# Altium project Zilents_TKL.PrjPCB
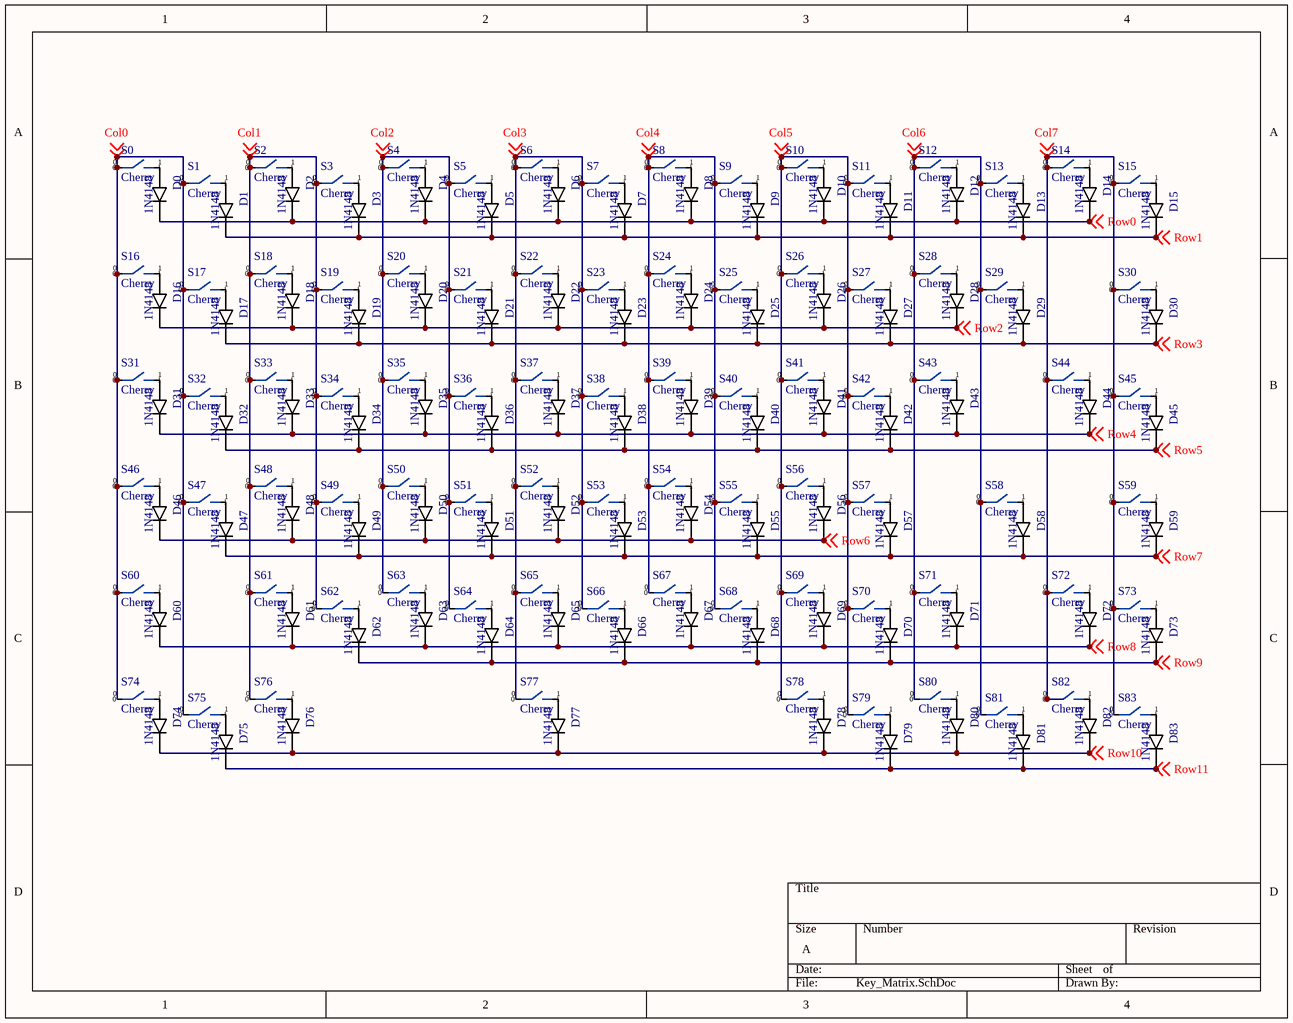
[diagram p0: Key_Matrix.SchDoc]
2 sheets, 337 parts. Net scope: global (net labels, ports and power ports of the same name join across sheets).
Board file: Yun75.PcbDoc
Sheets:
  Key_Matrix.SchDoc
  RGB_Matrix.SchDoc

## Sheet Key_Matrix.SchDoc
size A

### Parts
D0  1N4148  [DIOAD829W49L456D191_1N4148(Primary)]
D1  1N4148  [DIOAD829W49L456D191_1N4148(Primary)]
D2  1N4148  [DIOAD829W49L456D191_1N4148(Primary)]
D3  1N4148  [DIOAD829W49L456D191_1N4148(Primary)]
D4  1N4148  [DIOAD829W49L456D191_1N4148(Primary)]
D5  1N4148  [DIOAD829W49L456D191_1N4148(Primary)]
D6  1N4148  [DIOAD829W49L456D191_1N4148(Primary)]
D7  1N4148  [DIOAD829W49L456D191_1N4148(Primary)]
D8  1N4148  [DIOAD829W49L456D191_1N4148(Primary)]
D9  1N4148  [DIOAD829W49L456D191_1N4148(Primary)]
D10  1N4148  [DIOAD829W49L456D191_1N4148(Primary)]
D11  1N4148  [DIOAD829W49L456D191_1N4148(Primary)]
D12  1N4148  [DIOAD829W49L456D191_1N4148(Primary)]
D13  1N4148  [DIOAD829W49L456D191_1N4148(Primary)]
D14  1N4148  [DIOAD829W49L456D191_1N4148(Primary)]
D15  1N4148  [DIOAD829W49L456D191_1N4148(Primary)]
D16  1N4148  [DIOAD829W49L456D191_1N4148(Primary)]
D17  1N4148  [DIOAD829W49L456D191_1N4148(Primary)]
D18  1N4148  [DIOAD829W49L456D191_1N4148(Primary)]
D19  1N4148  [DIOAD829W49L456D191_1N4148(Primary)]
D20  1N4148  [DIOAD829W49L456D191_1N4148(Primary)]
D21  1N4148  [DIOAD829W49L456D191_1N4148(Primary)]
D22  1N4148  [DIOAD829W49L456D191_1N4148(Primary)]
D23  1N4148  [DIOAD829W49L456D191_1N4148(Primary)]
D24  1N4148  [DIOAD829W49L456D191_1N4148(Primary)]
D25  1N4148  [DIOAD829W49L456D191_1N4148(Primary)]
D26  1N4148  [DIOAD829W49L456D191_1N4148(Primary)]
D27  1N4148  [DIOAD829W49L456D191_1N4148(Primary)]
D28  1N4148  [DIOAD829W49L456D191_1N4148(Primary)]
D29  1N4148  [DIOAD829W49L456D191_1N4148(Primary)]
D30  1N4148  [DIOAD829W49L456D191_1N4148(Primary)]
D31  1N4148  [DIOAD829W49L456D191_1N4148(Primary)]
D32  1N4148  [DIOAD829W49L456D191_1N4148(Primary)]
D33  1N4148  [DIOAD829W49L456D191_1N4148(Primary)]
D34  1N4148  [DIOAD829W49L456D191_1N4148(Primary)]
D35  1N4148  [DIOAD829W49L456D191_1N4148(Primary)]
D36  1N4148  [DIOAD829W49L456D191_1N4148(Primary)]
D37  1N4148  [DIOAD829W49L456D191_1N4148(Primary)]
D38  1N4148  [DIOAD829W49L456D191_1N4148(Primary)]
D39  1N4148  [DIOAD829W49L456D191_1N4148(Primary)]
D40  1N4148  [DIOAD829W49L456D191_1N4148(Primary)]
D41  1N4148  [DIOAD829W49L456D191_1N4148(Primary)]
D42  1N4148  [DIOAD829W49L456D191_1N4148(Primary)]
D43  1N4148  [DIOAD829W49L456D191_1N4148(Primary)]
D44  1N4148  [DIOAD829W49L456D191_1N4148(Primary)]
D45  1N4148  [DIOAD829W49L456D191_1N4148(Primary)]
D46  1N4148  [DIOAD829W49L456D191_1N4148(Primary)]
D47  1N4148  [DIOAD829W49L456D191_1N4148(Primary)]
D48  1N4148  [DIOAD829W49L456D191_1N4148(Primary)]
D49  1N4148  [DIOAD829W49L456D191_1N4148(Primary)]
D50  1N4148  [DIOAD829W49L456D191_1N4148(Primary)]
D51  1N4148  [DIOAD829W49L456D191_1N4148(Primary)]
D52  1N4148  [DIOAD829W49L456D191_1N4148(Primary)]
D53  1N4148  [DIOAD829W49L456D191_1N4148(Primary)]
D54  1N4148  [DIOAD829W49L456D191_1N4148(Primary)]
D55  1N4148  [DIOAD829W49L456D191_1N4148(Primary)]
D56  1N4148  [DIOAD829W49L456D191_1N4148(Primary)]
D57  1N4148  [DIOAD829W49L456D191_1N4148(Primary)]
D58  1N4148  [DIOAD829W49L456D191_1N4148(Primary)]
D59  1N4148  [DIOAD829W49L456D191_1N4148(Primary)]
D60  1N4148  [DIOAD829W49L456D191_1N4148(Primary)]
D61  1N4148  [DIOAD829W49L456D191_1N4148(Primary)]
D62  1N4148  [DIOAD829W49L456D191_1N4148(Primary)]
D63  1N4148  [DIOAD829W49L456D191_1N4148(Primary)]
D64  1N4148  [DIOAD829W49L456D191_1N4148(Primary)]
D65  1N4148  [DIOAD829W49L456D191_1N4148(Primary)]
D66  1N4148  [DIOAD829W49L456D191_1N4148(Primary)]
D67  1N4148  [DIOAD829W49L456D191_1N4148(Primary)]
D68  1N4148  [DIOAD829W49L456D191_1N4148(Primary)]
D69  1N4148  [DIOAD829W49L456D191_1N4148(Primary)]
D70  1N4148  [DIOAD829W49L456D191_1N4148(Primary)]
D71  1N4148  [DIOAD829W49L456D191_1N4148(Primary)]
D72  1N4148  [DIOAD829W49L456D191_1N4148(Primary)]
D73  1N4148  [DIOAD829W49L456D191_1N4148(Primary)]
D74  1N4148  [DIOAD829W49L456D191_1N4148(Primary)]
D75  1N4148  [DIOAD829W49L456D191_1N4148(Primary)]
D76  1N4148  [DIOAD829W49L456D191_1N4148(Primary)]
D77  1N4148  [DIOAD829W49L456D191_1N4148(Primary)]
D78  1N4148  [DIOAD829W49L456D191_1N4148(Primary)]
D79  1N4148  [DIOAD829W49L456D191_1N4148(Primary)]
D80  1N4148  [DIOAD829W49L456D191_1N4148(Primary)]
D81  1N4148  [DIOAD829W49L456D191_1N4148(Primary)]
D82  1N4148  [DIOAD829W49L456D191_1N4148(Primary)]
D83  1N4148  [DIOAD829W49L456D191_1N4148(Primary)]
S0  Cherry  [CHERRY-MX-LED-1U]
S1  Cherry  [CHERRY-MX-LED-1U]
S2  Cherry  [CHERRY-MX-LED-1U]
S3  Cherry  [CHERRY-MX-LED-1U]
S4  Cherry  [CHERRY-MX-LED-1U]
S5  Cherry  [CHERRY-MX-LED-1U]
S6  Cherry  [CHERRY-MX-LED-1U]
S7  Cherry  [CHERRY-MX-LED-1U]
S8  Cherry  [CHERRY-MX-LED-1U]
S9  Cherry  [CHERRY-MX-LED-1U]
S10  Cherry  [CHERRY-MX-LED-1U]
S11  Cherry  [CHERRY-MX-LED-1U]
S12  Cherry  [CHERRY-MX-LED-1U]
S13  Cherry  [CHERRY-MX-LED-1U]
S14  Cherry  [CHERRY-MX-LED-1U]
S15  Cherry  [CHERRY-MX-LED-1U]
S16  Cherry  [CHERRY-MX-LED-1U]
S17  Cherry  [CHERRY-MX-LED-1U]
S18  Cherry  [CHERRY-MX-LED-1U]
S19  Cherry  [CHERRY-MX-LED-1U]
S20  Cherry  [CHERRY-MX-LED-1U]
S21  Cherry  [CHERRY-MX-LED-1U]
S22  Cherry  [CHERRY-MX-LED-1U]
S23  Cherry  [CHERRY-MX-LED-1U]
S24  Cherry  [CHERRY-MX-LED-1U]
S25  Cherry  [CHERRY-MX-LED-1U]
S26  Cherry  [CHERRY-MX-LED-1U]
S27  Cherry  [CHERRY-MX-LED-1U]
S28  Cherry  [CHERRY-MX-LED-1U]
S29  Cherry  [CHERRY-MX-LED-1U]
S30  Cherry  [CHERRY-MX-LED-1U]
S31  Cherry  [CHERRY-MX-LED-1U]
S32  Cherry  [CHERRY-MX-LED-1U]
S33  Cherry  [CHERRY-MX-LED-1U]
S34  Cherry  [CHERRY-MX-LED-1U]
S35  Cherry  [CHERRY-MX-LED-1U]
S36  Cherry  [CHERRY-MX-LED-1U]
S37  Cherry  [CHERRY-MX-LED-1U]
S38  Cherry  [CHERRY-MX-LED-1U]
S39  Cherry  [CHERRY-MX-LED-1U]
S40  Cherry  [CHERRY-MX-LED-1U]
S41  Cherry  [CHERRY-MX-LED-1U]
S42  Cherry  [CHERRY-MX-LED-1U]
S43  Cherry  [CHERRY-MX-LED-1U]
S44  Cherry  [CHERRY-MX-LED-1U]
S45  Cherry  [CHERRY-MX-LED-1U]
S46  Cherry  [CHERRY-MX-LED-1U]
S47  Cherry  [CHERRY-MX-LED-1U]
S48  Cherry  [CHERRY-MX-LED-1U]
S49  Cherry  [CHERRY-MX-LED-1U]
S50  Cherry  [CHERRY-MX-LED-1U]
S51  Cherry  [CHERRY-MX-LED-1U]
S52  Cherry  [CHERRY-MX-LED-1U]
S53  Cherry  [CHERRY-MX-LED-1U]
S54  Cherry  [CHERRY-MX-LED-1U]
S55  Cherry  [CHERRY-MX-LED-1U]
S56  Cherry  [CHERRY-MX-LED-1U]
S57  Cherry  [CHERRY-MX-LED-1U]
S58  Cherry  [CHERRY-MX-LED-1U]
S59  Cherry  [CHERRY-MX-LED-1U]
S60  Cherry  [CHERRY-MX-LED-1U]
S61  Cherry  [CHERRY-MX-LED-1U]
S62  Cherry  [CHERRY-MX-LED-1U]
S63  Cherry  [CHERRY-MX-LED-1U]
S64  Cherry  [CHERRY-MX-LED-1U]
S65  Cherry  [CHERRY-MX-LED-1U]
S66  Cherry  [CHERRY-MX-LED-1U]
S67  Cherry  [CHERRY-MX-LED-1U]
S68  Cherry  [CHERRY-MX-LED-1U]
S69  Cherry  [CHERRY-MX-LED-1U]
S70  Cherry  [CHERRY-MX-LED-1U]
S71  Cherry  [CHERRY-MX-LED-1U]
S72  Cherry  [CHERRY-MX-LED-1U]
S73  Cherry  [CHERRY-MX-LED-1U]
S74  Cherry  [CHERRY-MX-LED-1U]
S75  Cherry  [CHERRY-MX-LED-1U]
S76  Cherry  [CHERRY-MX-LED-1U]
S77  Cherry  [CHERRY-MX-LED-1U]
S78  Cherry  [CHERRY-MX-LED-1U]
S79  Cherry  [CHERRY-MX-LED-1U]
S80  Cherry  [CHERRY-MX-LED-1U]
S81  Cherry  [CHERRY-MX-LED-1U]
S82  Cherry  [CHERRY-MX-LED-1U]
S83  Cherry  [CHERRY-MX-LED-1U]

### Nets
Col0: S0.0 S1.0 S16.0 S17.0 S31.0 S32.0 S46.0 S47.0 S60.0 S74.0 S75.0 ; off-sheet Col0
Col1: S2.0 S3.0 S18.0 S19.0 S33.0 S34.0 S48.0 S49.0 S61.0 S62.0 S76.0 ; off-sheet Col1
Col2: S4.0 S5.0 S20.0 S21.0 S35.0 S36.0 S50.0 S51.0 S63.0 S64.0 ; off-sheet Col2
Col3: S6.0 S7.0 S22.0 S23.0 S37.0 S38.0 S52.0 S53.0 S65.0 S66.0 S77.0 ; off-sheet Col3
Col4: S8.0 S9.0 S24.0 S25.0 S39.0 S40.0 S54.0 S55.0 S67.0 S68.0 ; off-sheet Col4
Col5: S10.0 S11.0 S26.0 S27.0 S41.0 S42.0 S56.0 S57.0 S69.0 S70.0 S78.0 S79.0 ; off-sheet Col5
Col6: S12.0 S13.0 S28.0 S29.0 S43.0 S58.0 S71.0 S80.0 S81.0 ; off-sheet Col6
Col7: S14.0 S15.0 S30.0 S44.0 S45.0 S59.0 S72.0 S73.0 S82.0 S83.0 ; off-sheet Col7
Row0: D0.C D2.C D4.C D6.C D8.C D10.C D12.C D14.C ; off-sheet Row0
Row1: D1.C D3.C D5.C D7.C D9.C D11.C D13.C D15.C ; off-sheet Row1
Row2: D16.C D18.C D20.C D22.C D24.C D26.C D28.C ; off-sheet Row2
Row3: D17.C D19.C D21.C D23.C D25.C D27.C D29.C D30.C ; off-sheet Row3
Row4: D31.C D33.C D35.C D37.C D39.C D41.C D43.C D44.C ; off-sheet Row4
Row5: D32.C D34.C D36.C D38.C D40.C D42.C D45.C ; off-sheet Row5
Row6: D46.C D48.C D50.C D52.C D54.C D56.C ; off-sheet Row6
Row7: D47.C D49.C D51.C D53.C D55.C D57.C D58.C D59.C ; off-sheet Row7
Row8: D60.C D61.C D63.C D65.C D67.C D69.C D71.C D72.C ; off-sheet Row8
Row9: D62.C D64.C D66.C D68.C D70.C D73.C ; off-sheet Row9
Row10: D74.C D76.C D77.C D78.C D80.C D82.C ; off-sheet Row10
Row11: D75.C D79.C D81.C D83.C ; off-sheet Row11
NetD0_A: D0.A S0.1
NetD1_A: D1.A S1.1
NetD2_A: D2.A S2.1
NetD3_A: D3.A S3.1
NetD4_A: D4.A S4.1
NetD5_A: D5.A S5.1
NetD6_A: D6.A S6.1
NetD7_A: D7.A S7.1
NetD8_A: D8.A S8.1
NetD9_A: D9.A S9.1
NetD10_A: D10.A S10.1
NetD11_A: D11.A S11.1
NetD12_A: D12.A S12.1
NetD13_A: D13.A S13.1
NetD14_A: D14.A S14.1
NetD15_A: D15.A S15.1
NetD16_A: D16.A S16.1
NetD17_A: D17.A S17.1
NetD18_A: D18.A S18.1
NetD19_A: D19.A S19.1
NetD20_A: D20.A S20.1
NetD21_A: D21.A S21.1
NetD22_A: D22.A S22.1
NetD23_A: D23.A S23.1
NetD24_A: D24.A S24.1
NetD25_A: D25.A S25.1
NetD26_A: D26.A S26.1
NetD27_A: D27.A S27.1
NetD28_A: D28.A S28.1
NetD29_A: D29.A S29.1
NetD30_A: D30.A S30.1
NetD31_A: D31.A S31.1
NetD32_A: D32.A S32.1
NetD33_A: D33.A S33.1
NetD34_A: D34.A S34.1
NetD35_A: D35.A S35.1
NetD36_A: D36.A S36.1
NetD37_A: D37.A S37.1
NetD38_A: D38.A S38.1
NetD39_A: D39.A S39.1
NetD40_A: D40.A S40.1
NetD41_A: D41.A S41.1
NetD42_A: D42.A S42.1
NetD43_A: D43.A S43.1
NetD44_A: D44.A S44.1
NetD45_A: D45.A S45.1
NetD46_A: D46.A S46.1
NetD47_A: D47.A S47.1
NetD48_A: D48.A S48.1
NetD49_A: D49.A S49.1
NetD50_A: D50.A S50.1
NetD51_A: D51.A S51.1
NetD52_A: D52.A S52.1
NetD53_A: D53.A S53.1
NetD54_A: D54.A S54.1
NetD55_A: D55.A S55.1
NetD56_A: D56.A S56.1
NetD57_A: D57.A S57.1
NetD58_A: D58.A S58.1
NetD59_A: D59.A S59.1
NetD60_A: D60.A S60.1
NetD61_A: D61.A S61.1
NetD62_A: D62.A S62.1
NetD63_A: D63.A S63.1
NetD64_A: D64.A S64.1
NetD65_A: D65.A S65.1
NetD66_A: D66.A S66.1
NetD67_A: D67.A S67.1
NetD68_A: D68.A S68.1
NetD69_A: D69.A S69.1
NetD70_A: D70.A S70.1
NetD71_A: D71.A S71.1
NetD72_A: D72.A S72.1
NetD73_A: D73.A S73.1
NetD74_A: D74.A S74.1
NetD75_A: D75.A S75.1
NetD76_A: D76.A S76.1
NetD77_A: D77.A S77.1
NetD78_A: D78.A S78.1
NetD79_A: D79.A S79.1
NetD80_A: D80.A S80.1
NetD81_A: D81.A S81.1
NetD82_A: D82.A S82.1
NetD83_A: D83.A S83.1

### Library data of the parts
D0-D83 = 1N4148: Diode Small Signal Switching 100V 0.3A 2-Pin DO-35; MF: MICROSS/On Semiconductor; Package: DO-35 Vishay; Availability: Unavailable; MP: 1N4148; SnapEDA_Link: https://www.snapeda.com/parts/1N4148/MICROSS/On%20Semiconductor/view-part/?ref=snap; Price: None; Value: *
S0-S83 = Cherry_Switch: Cherry SPST Keyswitch

## Sheet RGB_Matrix.SchDoc
size B
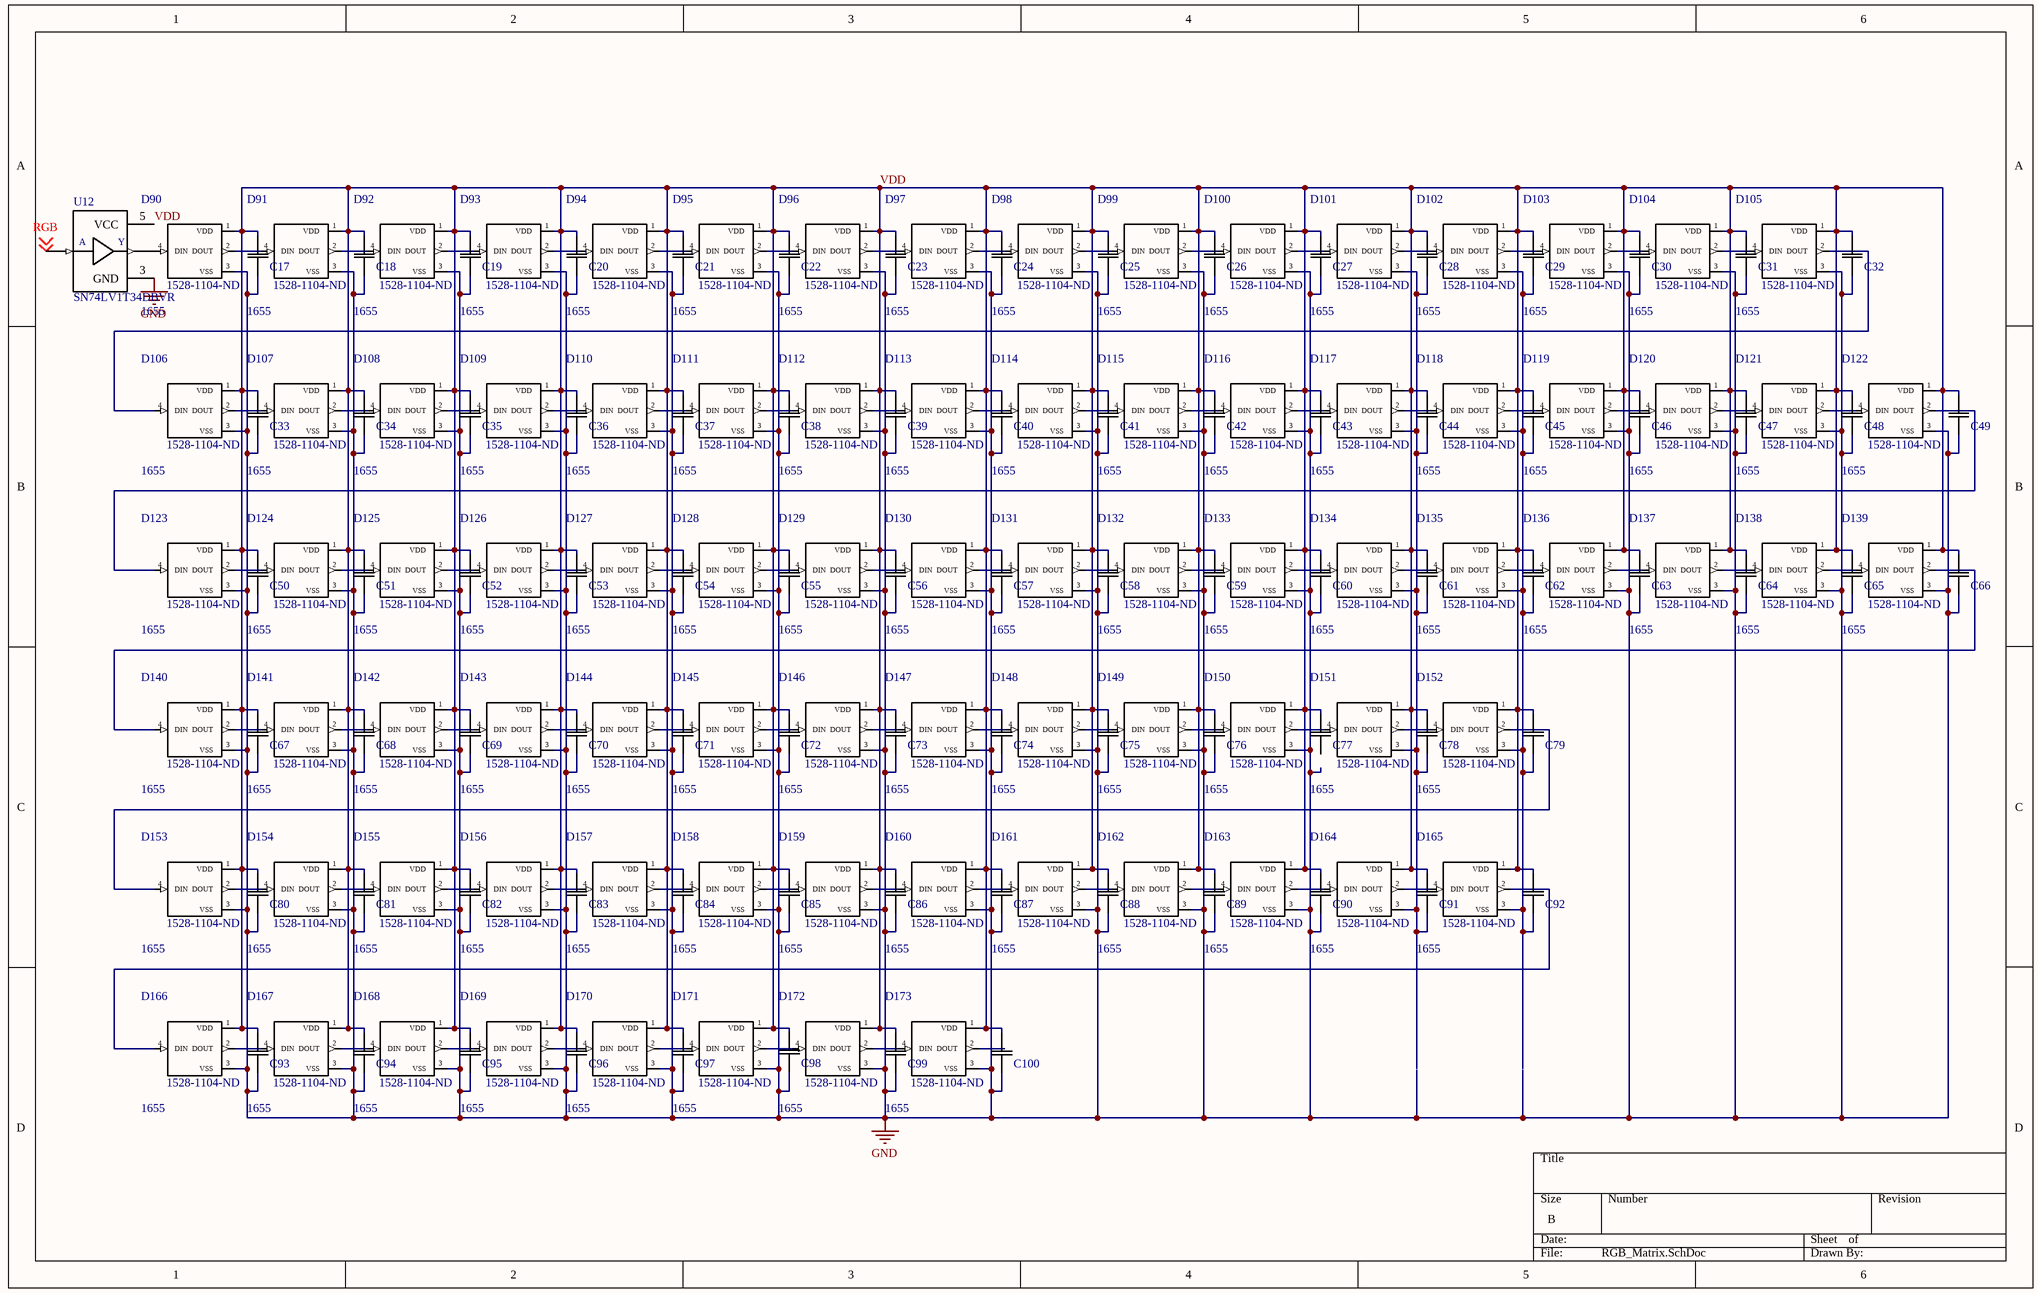
[diagram p1: RGB_Matrix.SchDoc]

### Parts
C17  Part Number: RCER71H104K0DBH03A  [RCER71H104K0DBH0]  (value not drawn)
C18  Part Number: RCER71H104K0DBH03A  [RCER71H104K0DBH0]  (value not drawn)
C19  Part Number: RCER71H104K0DBH03A  [RCER71H104K0DBH0]  (value not drawn)
C20  Part Number: RCER71H104K0DBH03A  [RCER71H104K0DBH0]  (value not drawn)
C21  Part Number: RCER71H104K0DBH03A  [RCER71H104K0DBH0]  (value not drawn)
C22  Part Number: RCER71H104K0DBH03A  [RCER71H104K0DBH0]  (value not drawn)
C23  Part Number: RCER71H104K0DBH03A  [RCER71H104K0DBH0]  (value not drawn)
C24  Part Number: RCER71H104K0DBH03A  [RCER71H104K0DBH0]  (value not drawn)
C25  Part Number: RCER71H104K0DBH03A  [RCER71H104K0DBH0]  (value not drawn)
C26  Part Number: RCER71H104K0DBH03A  [RCER71H104K0DBH0]  (value not drawn)
C27  Part Number: RCER71H104K0DBH03A  [RCER71H104K0DBH0]  (value not drawn)
C28  Part Number: RCER71H104K0DBH03A  [RCER71H104K0DBH0]  (value not drawn)
C29  Part Number: RCER71H104K0DBH03A  [RCER71H104K0DBH0]  (value not drawn)
C30  Part Number: RCER71H104K0DBH03A  [RCER71H104K0DBH0]  (value not drawn)
C31  Part Number: RCER71H104K0DBH03A  [RCER71H104K0DBH0]  (value not drawn)
C32  Part Number: RCER71H104K0DBH03A  [RCER71H104K0DBH0]  (value not drawn)
C33  Part Number: RCER71H104K0DBH03A  [RCER71H104K0DBH0]  (value not drawn)
C34  Part Number: RCER71H104K0DBH03A  [RCER71H104K0DBH0]  (value not drawn)
C35  Part Number: RCER71H104K0DBH03A  [RCER71H104K0DBH0]  (value not drawn)
C36  Part Number: RCER71H104K0DBH03A  [RCER71H104K0DBH0]  (value not drawn)
C37  Part Number: RCER71H104K0DBH03A  [RCER71H104K0DBH0]  (value not drawn)
C38  Part Number: RCER71H104K0DBH03A  [RCER71H104K0DBH0]  (value not drawn)
C39  Part Number: RCER71H104K0DBH03A  [RCER71H104K0DBH0]  (value not drawn)
C40  Part Number: RCER71H104K0DBH03A  [RCER71H104K0DBH0]  (value not drawn)
C41  Part Number: RCER71H104K0DBH03A  [RCER71H104K0DBH0]  (value not drawn)
C42  Part Number: RCER71H104K0DBH03A  [RCER71H104K0DBH0]  (value not drawn)
C43  Part Number: RCER71H104K0DBH03A  [RCER71H104K0DBH0]  (value not drawn)
C44  Part Number: RCER71H104K0DBH03A  [RCER71H104K0DBH0]  (value not drawn)
C45  Part Number: RCER71H104K0DBH03A  [RCER71H104K0DBH0]  (value not drawn)
C46  Part Number: RCER71H104K0DBH03A  [RCER71H104K0DBH0]  (value not drawn)
C47  Part Number: RCER71H104K0DBH03A  [RCER71H104K0DBH0]  (value not drawn)
C48  Part Number: RCER71H104K0DBH03A  [RCER71H104K0DBH0]  (value not drawn)
C49  Part Number: RCER71H104K0DBH03A  [RCER71H104K0DBH0]  (value not drawn)
C50  Part Number: RCER71H104K0DBH03A  [RCER71H104K0DBH0]  (value not drawn)
C51  Part Number: RCER71H104K0DBH03A  [RCER71H104K0DBH0]  (value not drawn)
C52  Part Number: RCER71H104K0DBH03A  [RCER71H104K0DBH0]  (value not drawn)
C53  Part Number: RCER71H104K0DBH03A  [RCER71H104K0DBH0]  (value not drawn)
C54  Part Number: RCER71H104K0DBH03A  [RCER71H104K0DBH0]  (value not drawn)
C55  Part Number: RCER71H104K0DBH03A  [RCER71H104K0DBH0]  (value not drawn)
C56  Part Number: RCER71H104K0DBH03A  [RCER71H104K0DBH0]  (value not drawn)
C57  Part Number: RCER71H104K0DBH03A  [RCER71H104K0DBH0]  (value not drawn)
C58  Part Number: RCER71H104K0DBH03A  [RCER71H104K0DBH0]  (value not drawn)
C59  Part Number: RCER71H104K0DBH03A  [RCER71H104K0DBH0]  (value not drawn)
C60  Part Number: RCER71H104K0DBH03A  [RCER71H104K0DBH0]  (value not drawn)
C61  Part Number: RCER71H104K0DBH03A  [RCER71H104K0DBH0]  (value not drawn)
C62  Part Number: RCER71H104K0DBH03A  [RCER71H104K0DBH0]  (value not drawn)
C63  Part Number: RCER71H104K0DBH03A  [RCER71H104K0DBH0]  (value not drawn)
C64  Part Number: RCER71H104K0DBH03A  [RCER71H104K0DBH0]  (value not drawn)
C65  Part Number: RCER71H104K0DBH03A  [RCER71H104K0DBH0]  (value not drawn)
C66  Part Number: RCER71H104K0DBH03A  [RCER71H104K0DBH0]  (value not drawn)
C67  Part Number: RCER71H104K0DBH03A  [RCER71H104K0DBH0]  (value not drawn)
C68  Part Number: RCER71H104K0DBH03A  [RCER71H104K0DBH0]  (value not drawn)
C69  Part Number: RCER71H104K0DBH03A  [RCER71H104K0DBH0]  (value not drawn)
C70  Part Number: RCER71H104K0DBH03A  [RCER71H104K0DBH0]  (value not drawn)
C71  Part Number: RCER71H104K0DBH03A  [RCER71H104K0DBH0]  (value not drawn)
C72  Part Number: RCER71H104K0DBH03A  [RCER71H104K0DBH0]  (value not drawn)
C73  Part Number: RCER71H104K0DBH03A  [RCER71H104K0DBH0]  (value not drawn)
C74  Part Number: RCER71H104K0DBH03A  [RCER71H104K0DBH0]  (value not drawn)
C75  Part Number: RCER71H104K0DBH03A  [RCER71H104K0DBH0]  (value not drawn)
C76  Part Number: RCER71H104K0DBH03A  [RCER71H104K0DBH0]  (value not drawn)
C77  Part Number: RCER71H104K0DBH03A  [RCER71H104K0DBH0]  (value not drawn)
C78  Part Number: RCER71H104K0DBH03A  [RCER71H104K0DBH0]  (value not drawn)
C79  Part Number: RCER71H104K0DBH03A  [RCER71H104K0DBH0]  (value not drawn)
C80  Part Number: RCER71H104K0DBH03A  [RCER71H104K0DBH0]  (value not drawn)
C81  Part Number: RCER71H104K0DBH03A  [RCER71H104K0DBH0]  (value not drawn)
C82  Part Number: RCER71H104K0DBH03A  [RCER71H104K0DBH0]  (value not drawn)
C83  Part Number: RCER71H104K0DBH03A  [RCER71H104K0DBH0]  (value not drawn)
C84  Part Number: RCER71H104K0DBH03A  [RCER71H104K0DBH0]  (value not drawn)
C85  Part Number: RCER71H104K0DBH03A  [RCER71H104K0DBH0]  (value not drawn)
C86  Part Number: RCER71H104K0DBH03A  [RCER71H104K0DBH0]  (value not drawn)
C87  Part Number: RCER71H104K0DBH03A  [RCER71H104K0DBH0]  (value not drawn)
C88  Part Number: RCER71H104K0DBH03A  [RCER71H104K0DBH0]  (value not drawn)
C89  Part Number: RCER71H104K0DBH03A  [RCER71H104K0DBH0]  (value not drawn)
C90  Part Number: RCER71H104K0DBH03A  [RCER71H104K0DBH0]  (value not drawn)
C91  Part Number: RCER71H104K0DBH03A  [RCER71H104K0DBH0]  (value not drawn)
C92  Part Number: RCER71H104K0DBH03A  [RCER71H104K0DBH0]  (value not drawn)
C93  Part Number: RCER71H104K0DBH03A  [RCER71H104K0DBH0]  (value not drawn)
C94  Part Number: RCER71H104K0DBH03A  [RCER71H104K0DBH0]  (value not drawn)
C95  Part Number: RCER71H104K0DBH03A  [RCER71H104K0DBH0]  (value not drawn)
C96  Part Number: RCER71H104K0DBH03A  [RCER71H104K0DBH0]  (value not drawn)
C97  Part Number: RCER71H104K0DBH03A  [RCER71H104K0DBH0]  (value not drawn)
C98  Part Number: RCER71H104K0DBH03A  [RCER71H104K0DBH0]  (value not drawn)
C99  Part Number: RCER71H104K0DBH03A  [RCER71H104K0DBH0]  (value not drawn)
C100  Part Number: RCER71H104K0DBH03A  [RCER71H104K0DBH0]  (value not drawn)
D90  1655  Supplier Part Number 1: 1528-1104-ND  [WS2182b_Underside]
D91  1655  Supplier Part Number 1: 1528-1104-ND  [WS2182b_Underside]
D92  1655  Supplier Part Number 1: 1528-1104-ND  [WS2182b_Underside]
D93  1655  Supplier Part Number 1: 1528-1104-ND  [WS2182b_Underside]
D94  1655  Supplier Part Number 1: 1528-1104-ND  [WS2182b_Underside]
D95  1655  Supplier Part Number 1: 1528-1104-ND  [WS2182b_Underside]
D96  1655  Supplier Part Number 1: 1528-1104-ND  [WS2182b_Underside]
D97  1655  Supplier Part Number 1: 1528-1104-ND  [WS2182b_Underside]
D98  1655  Supplier Part Number 1: 1528-1104-ND  [WS2182b_Underside]
D99  1655  Supplier Part Number 1: 1528-1104-ND  [WS2182b_Underside]
D100  1655  Supplier Part Number 1: 1528-1104-ND  [WS2182b_Underside]
D101  1655  Supplier Part Number 1: 1528-1104-ND  [WS2182b_Underside]
D102  1655  Supplier Part Number 1: 1528-1104-ND  [WS2182b_Underside]
D103  1655  Supplier Part Number 1: 1528-1104-ND  [WS2182b_Underside]
D104  1655  Supplier Part Number 1: 1528-1104-ND  [WS2182b_Underside]
D105  1655  Supplier Part Number 1: 1528-1104-ND  [WS2182b_Underside]
D106  1655  Supplier Part Number 1: 1528-1104-ND  [WS2182b_Underside]
D107  1655  Supplier Part Number 1: 1528-1104-ND  [WS2182b_Underside]
D108  1655  Supplier Part Number 1: 1528-1104-ND  [WS2182b_Underside]
D109  1655  Supplier Part Number 1: 1528-1104-ND  [WS2182b_Underside]
D110  1655  Supplier Part Number 1: 1528-1104-ND  [WS2182b_Underside]
D111  1655  Supplier Part Number 1: 1528-1104-ND  [WS2182b_Underside]
D112  1655  Supplier Part Number 1: 1528-1104-ND  [WS2182b_Underside]
D113  1655  Supplier Part Number 1: 1528-1104-ND  [WS2182b_Underside]
D114  1655  Supplier Part Number 1: 1528-1104-ND  [WS2182b_Underside]
D115  1655  Supplier Part Number 1: 1528-1104-ND  [WS2182b_Underside]
D116  1655  Supplier Part Number 1: 1528-1104-ND  [WS2182b_Underside]
D117  1655  Supplier Part Number 1: 1528-1104-ND  [WS2182b_Underside]
D118  1655  Supplier Part Number 1: 1528-1104-ND  [WS2182b_Underside]
D119  1655  Supplier Part Number 1: 1528-1104-ND  [WS2182b_Underside]
D120  1655  Supplier Part Number 1: 1528-1104-ND  [WS2182b_Underside]
D121  1655  Supplier Part Number 1: 1528-1104-ND  [WS2182b_Underside]
D122  1655  Supplier Part Number 1: 1528-1104-ND  [WS2182b_Underside]
D123  1655  Supplier Part Number 1: 1528-1104-ND  [WS2182b_Underside]
D124  1655  Supplier Part Number 1: 1528-1104-ND  [WS2182b_Underside]
D125  1655  Supplier Part Number 1: 1528-1104-ND  [WS2182b_Underside]
D126  1655  Supplier Part Number 1: 1528-1104-ND  [WS2182b_Underside]
D127  1655  Supplier Part Number 1: 1528-1104-ND  [WS2182b_Underside]
D128  1655  Supplier Part Number 1: 1528-1104-ND  [WS2182b_Underside]
D129  1655  Supplier Part Number 1: 1528-1104-ND  [WS2182b_Underside]
D130  1655  Supplier Part Number 1: 1528-1104-ND  [WS2182b_Underside]
D131  1655  Supplier Part Number 1: 1528-1104-ND  [WS2182b_Underside]
D132  1655  Supplier Part Number 1: 1528-1104-ND  [WS2182b_Underside]
D133  1655  Supplier Part Number 1: 1528-1104-ND  [WS2182b_Underside]
D134  1655  Supplier Part Number 1: 1528-1104-ND  [WS2182b_Underside]
D135  1655  Supplier Part Number 1: 1528-1104-ND  [WS2182b_Underside]
D136  1655  Supplier Part Number 1: 1528-1104-ND  [WS2182b_Underside]
D137  1655  Supplier Part Number 1: 1528-1104-ND  [WS2182b_Underside]
D138  1655  Supplier Part Number 1: 1528-1104-ND  [WS2182b_Underside]
D139  1655  Supplier Part Number 1: 1528-1104-ND  [WS2182b_Underside]
D140  1655  Supplier Part Number 1: 1528-1104-ND  [WS2182b_Underside]
D141  1655  Supplier Part Number 1: 1528-1104-ND  [WS2182b_Underside]
D142  1655  Supplier Part Number 1: 1528-1104-ND  [WS2182b_Underside]
D143  1655  Supplier Part Number 1: 1528-1104-ND  [WS2182b_Underside]
D144  1655  Supplier Part Number 1: 1528-1104-ND  [WS2182b_Underside]
D145  1655  Supplier Part Number 1: 1528-1104-ND  [WS2182b_Underside]
D146  1655  Supplier Part Number 1: 1528-1104-ND  [WS2182b_Underside]
D147  1655  Supplier Part Number 1: 1528-1104-ND  [WS2182b_Underside]
D148  1655  Supplier Part Number 1: 1528-1104-ND  [WS2182b_Underside]
D149  1655  Supplier Part Number 1: 1528-1104-ND  [WS2182b_Underside]
D150  1655  Supplier Part Number 1: 1528-1104-ND  [WS2182b_Underside]
D151  1655  Supplier Part Number 1: 1528-1104-ND  [WS2182b_Underside]
D152  1655  Supplier Part Number 1: 1528-1104-ND  [WS2182b_Underside]
D153  1655  Supplier Part Number 1: 1528-1104-ND  [WS2182b_Underside]
D154  1655  Supplier Part Number 1: 1528-1104-ND  [WS2182b_Underside]
D155  1655  Supplier Part Number 1: 1528-1104-ND  [WS2182b_Underside]
D156  1655  Supplier Part Number 1: 1528-1104-ND  [WS2182b_Underside]
D157  1655  Supplier Part Number 1: 1528-1104-ND  [WS2182b_Underside]
D158  1655  Supplier Part Number 1: 1528-1104-ND  [WS2182b_Underside]
D159  1655  Supplier Part Number 1: 1528-1104-ND  [WS2182b_Underside]
D160  1655  Supplier Part Number 1: 1528-1104-ND  [WS2182b_Underside]
D161  1655  Supplier Part Number 1: 1528-1104-ND  [WS2182b_Underside]
D162  1655  Supplier Part Number 1: 1528-1104-ND  [WS2182b_Underside]
D163  1655  Supplier Part Number 1: 1528-1104-ND  [WS2182b_Underside]
D164  1655  Supplier Part Number 1: 1528-1104-ND  [WS2182b_Underside]
D165  1655  Supplier Part Number 1: 1528-1104-ND  [WS2182b_Underside]
D166  1655  Supplier Part Number 1: 1528-1104-ND  [WS2182b_Underside]
D167  1655  Supplier Part Number 1: 1528-1104-ND  [WS2182b_Underside]
D168  1655  Supplier Part Number 1: 1528-1104-ND  [WS2182b_Underside]
D169  1655  Supplier Part Number 1: 1528-1104-ND  [WS2182b_Underside]
D170  1655  Supplier Part Number 1: 1528-1104-ND  [WS2182b_Underside]
D171  1655  Supplier Part Number 1: 1528-1104-ND  [WS2182b_Underside]
D172  1655  Supplier Part Number 1: 1528-1104-ND  [WS2182b_Underside]
D173  1655  Supplier Part Number 1: 1528-1104-ND  [WS2182b_Underside]
U12  SN74LV1T34DBVR  [SOT95P280X145-5N]

### Nets
GND: C17.2 C18.2 C19.2 C20.2 C21.2 C22.2 C23.2 C24.2 C25.2 C26.2 C27.2 C30.2 C31.2 C32.2 C33.2 C34.2 C35.2 C36.2 C37.2 C38.2 C39.2 C40.2 C41.2 C42.2 C43.2 C46.2 C47.2 C48.2 C49.2 C50.2 C51.2 C52.2 C53.2 C54.2 C55.2 C56.2 C57.2 C58.2 C59.2 C60.2 C63.2 C64.2 C65.2 C66.2 C67.2 C68.2 C69.2 C70.2 C71.2 C72.2 C73.2 C74.2 C75.2 C76.2 C80.2 C81.2 C82.2 C83.2 C84.2 C85.2 C86.2 C87.2 C88.2 C89.2 C90.2 C93.2 C94.2 C95.2 C96.2 C97.2 C98.2 C99.2 C100.2 D90.3(VSS) D91.3(VSS) D92.3(VSS) D93.3(VSS) D94.3(VSS) D95.3(VSS) D96.3(VSS) D97.3(VSS) D98.3(VSS) D99.3(VSS) D100.3(VSS) D103.3(VSS) D104.3(VSS) D105.3(VSS) D106.3(VSS) D107.3(VSS) D108.3(VSS) D109.3(VSS) D110.3(VSS) D111.3(VSS) D112.3(VSS) D113.3(VSS) D114.3(VSS) D115.3(VSS) D116.3(VSS) D119.3(VSS) D120.3(VSS) D121.3(VSS) D122.3(VSS) D123.3(VSS) D124.3(VSS) D125.3(VSS) D126.3(VSS) D127.3(VSS) D128.3(VSS) D129.3(VSS) D130.3(VSS) D131.3(VSS) D132.3(VSS) D133.3(VSS) D136.3(VSS) D137.3(VSS) D138.3(VSS) D139.3(VSS) D140.3(VSS) D141.3(VSS) D142.3(VSS) D143.3(VSS) D144.3(VSS) D145.3(VSS) D146.3(VSS) D147.3(VSS) D148.3(VSS) D149.3(VSS) D150.3(VSS) D153.3(VSS) D154.3(VSS) D155.3(VSS) D156.3(VSS) D157.3(VSS) D158.3(VSS) D159.3(VSS) D160.3(VSS) D161.3(VSS) D162.3(VSS) D163.3(VSS) D166.3(VSS) D167.3(VSS) D168.3(VSS) D169.3(VSS) D170.3(VSS) D171.3(VSS) D172.3(VSS) D173.3(VSS) U12.3(GND)
RGB: U12.2(A) ; off-sheet RGB
VDD: C17.1 C18.1 C19.1 C20.1 C21.1 C22.1 C23.1 C24.1 C25.1 C26.1 C27.1 C28.1 C29.1 C30.1 C31.1 C32.1 C33.1 C34.1 C35.1 C36.1 C37.1 C38.1 C39.1 C40.1 C41.1 C42.1 C43.1 C45.1 C46.1 C47.1 C48.1 C49.1 C50.1 C51.1 C52.1 C53.1 C54.1 C55.1 C56.1 C57.1 C58.1 C59.1 C60.1 C62.1 C63.1 C64.1 C65.1 C66.1 C67.1 C68.1 C69.1 C70.1 C71.1 C72.1 C73.1 C74.1 C75.1 C76.1 C77.1 C79.1 C80.1 C81.1 C82.1 C83.1 C84.1 C85.1 C86.1 C87.1 C88.1 C89.1 C90.1 C92.1 C93.1 C94.1 C95.1 C96.1 C97.1 C98.1 C99.1 C100.1 D90.1(VDD) D91.1(VDD) D92.1(VDD) D93.1(VDD) D94.1(VDD) D95.1(VDD) D96.1(VDD) D97.1(VDD) D98.1(VDD) D99.1(VDD) D100.1(VDD) D101.1(VDD) D102.1(VDD) D103.1(VDD) D104.1(VDD) D105.1(VDD) D106.1(VDD) D107.1(VDD) D108.1(VDD) D109.1(VDD) D110.1(VDD) D111.1(VDD) D112.1(VDD) D113.1(VDD) D114.1(VDD) D115.1(VDD) D116.1(VDD) D118.1(VDD) D119.1(VDD) D120.1(VDD) D121.1(VDD) D122.1(VDD) D123.1(VDD) D124.1(VDD) D125.1(VDD) D126.1(VDD) D127.1(VDD) D128.1(VDD) D129.1(VDD) D130.1(VDD) D131.1(VDD) D132.1(VDD) D133.1(VDD) D135.1(VDD) D136.1(VDD) D137.1(VDD) D138.1(VDD) D139.1(VDD) D140.1(VDD) D141.1(VDD) D142.1(VDD) D143.1(VDD) D144.1(VDD) D145.1(VDD) D146.1(VDD) D147.1(VDD) D148.1(VDD) D149.1(VDD) D150.1(VDD) D152.1(VDD) D153.1(VDD) D154.1(VDD) D155.1(VDD) D156.1(VDD) D157.1(VDD) D158.1(VDD) D159.1(VDD) D160.1(VDD) D161.1(VDD) D162.1(VDD) D163.1(VDD) D165.1(VDD) D166.1(VDD) D167.1(VDD) D168.1(VDD) D169.1(VDD) D170.1(VDD) D171.1(VDD) D172.1(VDD) D173.1(VDD) U12.5(VCC)
NetC28_2: C28.2 C44.2 C61.2 C78.2 C91.2 D101.3(VSS) D117.3(VSS) D134.3(VSS) D151.3(VSS) D164.3(VSS)
NetC29_2: C29.2 C45.2 C62.2 C79.2 C92.2 D102.3(VSS) D118.3(VSS) D135.3(VSS) D152.3(VSS) D165.3(VSS)
NetC44_1: C44.1 C61.1 C78.1 C91.1 D117.1(VDD) D134.1(VDD) D151.1(VDD) D164.1(VDD)
NetD90_2: D90.2(DOUT) D91.4(DIN)
NetD90_4: D90.4(DIN) U12.4(Y)
NetD91_2: D91.2(DOUT) D92.4(DIN)
NetD92_2: D92.2(DOUT) D93.4(DIN)
NetD93_2: D93.2(DOUT) D94.4(DIN)
NetD94_2: D94.2(DOUT) D95.4(DIN)
NetD95_2: D95.2(DOUT) D96.4(DIN)
NetD96_2: D96.2(DOUT) D97.4(DIN)
NetD97_2: D97.2(DOUT) D98.4(DIN)
NetD98_2: D98.2(DOUT) D99.4(DIN)
NetD99_2: D99.2(DOUT) D100.4(DIN)
NetD100_2: D100.2(DOUT) D101.4(DIN)
NetD101_2: D101.2(DOUT) D102.4(DIN)
NetD102_2: D102.2(DOUT) D103.4(DIN)
NetD103_2: D103.2(DOUT) D104.4(DIN)
NetD104_2: D104.2(DOUT) D105.4(DIN)
NetD105_2: D105.2(DOUT) D106.4(DIN)
NetD106_2: D106.2(DOUT) D107.4(DIN)
NetD107_2: D107.2(DOUT) D108.4(DIN)
NetD108_2: D108.2(DOUT) D109.4(DIN)
NetD109_2: D109.2(DOUT) D110.4(DIN)
NetD110_2: D110.2(DOUT) D111.4(DIN)
NetD111_2: D111.2(DOUT) D112.4(DIN)
NetD112_2: D112.2(DOUT) D113.4(DIN)
NetD113_2: D113.2(DOUT) D114.4(DIN)
NetD114_2: D114.2(DOUT) D115.4(DIN)
NetD115_2: D115.2(DOUT) D116.4(DIN)
NetD116_2: D116.2(DOUT) D117.4(DIN)
NetD117_2: D117.2(DOUT) D118.4(DIN)
NetD118_2: D118.2(DOUT) D119.4(DIN)
NetD119_2: D119.2(DOUT) D120.4(DIN)
NetD120_2: D120.2(DOUT) D121.4(DIN)
NetD121_2: D121.2(DOUT) D122.4(DIN)
NetD122_2: D122.2(DOUT) D123.4(DIN)
NetD123_2: D123.2(DOUT) D124.4(DIN)
NetD124_2: D124.2(DOUT) D125.4(DIN)
NetD125_2: D125.2(DOUT) D126.4(DIN)
NetD126_2: D126.2(DOUT) D127.4(DIN)
NetD127_2: D127.2(DOUT) D128.4(DIN)
NetD128_2: D128.2(DOUT) D129.4(DIN)
NetD129_2: D129.2(DOUT) D130.4(DIN)
NetD130_2: D130.2(DOUT) D131.4(DIN)
NetD131_2: D131.2(DOUT) D132.4(DIN)
NetD132_2: D132.2(DOUT) D133.4(DIN)
NetD133_2: D133.2(DOUT) D134.4(DIN)
NetD134_2: D134.2(DOUT) D135.4(DIN)
NetD135_2: D135.2(DOUT) D136.4(DIN)
NetD136_2: D136.2(DOUT) D137.4(DIN)
NetD137_2: D137.2(DOUT) D138.4(DIN)
NetD138_2: D138.2(DOUT) D139.4(DIN)
NetD139_2: D139.2(DOUT) D140.4(DIN)
NetD140_2: D140.2(DOUT) D141.4(DIN)
NetD141_2: D141.2(DOUT) D142.4(DIN)
NetD142_2: D142.2(DOUT) D143.4(DIN)
NetD143_2: D143.2(DOUT) D144.4(DIN)
NetD144_2: D144.2(DOUT) D145.4(DIN)
NetD145_2: D145.2(DOUT) D146.4(DIN)
NetD146_2: D146.2(DOUT) D147.4(DIN)
NetD147_2: D147.2(DOUT) D148.4(DIN)
NetD148_2: D148.2(DOUT) D149.4(DIN)
NetD149_2: D149.2(DOUT) D150.4(DIN)
NetD150_2: D150.2(DOUT) D151.4(DIN)
NetD151_2: D151.2(DOUT) D152.4(DIN)
NetD152_2: D152.2(DOUT) D153.4(DIN)
NetD153_2: D153.2(DOUT) D154.4(DIN)
NetD154_2: D154.2(DOUT) D155.4(DIN)
NetD155_2: D155.2(DOUT) D156.4(DIN)
NetD156_2: D156.2(DOUT) D157.4(DIN)
NetD157_2: D157.2(DOUT) D158.4(DIN)
NetD158_2: D158.2(DOUT) D159.4(DIN)
NetD159_2: D159.2(DOUT) D160.4(DIN)
NetD160_2: D160.2(DOUT) D161.4(DIN)
NetD161_2: D161.2(DOUT) D162.4(DIN)
NetD162_2: D162.2(DOUT) D163.4(DIN)
NetD163_2: D163.2(DOUT) D164.4(DIN)
NetD164_2: D164.2(DOUT) D165.4(DIN)
NetD165_2: D165.2(DOUT) D166.4(DIN)
NetD166_2: D166.2(DOUT) D167.4(DIN)
NetD167_2: D167.2(DOUT) D168.4(DIN)
NetD168_2: D168.2(DOUT) D169.4(DIN)
NetD169_2: D169.2(DOUT) D170.4(DIN)
NetD170_2: D170.2(DOUT) D171.4(DIN)
NetD171_2: D171.2(DOUT) D172.4(DIN)
NetD172_2: D172.2(DOUT) D173.4(DIN)

Not connected (* = marked no-connect by the designer): C77 2; D173 2(DOUT)

### Library data of the parts
C17-C100 = RCER71H104K0DBH0: No Description Available; Vendor: Murata; Copyright: Copyright (C) 2015 Accelerated Designs. All rights reserved; Manufacturer_Part_Number: RCER71H104K0DBH03A; Value: Value
D90-D173 = 1655: Ws2812b 5050 Rgb Led With Integrated Driver Chip Pack Of 10; MF: Adafruit; Availability: Good; MP: 1655; Price: 4.48 USD; SnapEDA_Link: https://www.snapeda.com/parts/1655/Adafruit%20Industries%20LLC/view-part/?ref=snap; Package: Adafruit; Value: *; Supplier 1: Digi-Key
U12 = SN74LV1T34DBVR: Single Power Supply BUFFER Logic Level Shifter _no enable_ 5-SOT-23 -40 to 125; MF: Texas Instruments; Availability: Unavailable; Price: None; Package: SOT-23 Texas Instruments; MP: SN74LV1T34DBVR; SnapEDA_Link: https://www.snapeda.com/parts/SN74LV1T34DBVR/Texas%20Instruments/view-part/?ref=snap; Value: *